# Altium schematic sheet 02_POWER.SchDoc: =GlobalProjectName
size 594 x 420 mm; CheckedBy: A_D; Author: A_D; SheetNumber: 2; SheetTotal: 2; PageSetup: Record=PageOptions|CenterHorizontal=True|CenterVertical=True|PrintScale=0.70|XCorrection=1.00|YCorrection=1.00|PrintKind=2|BorderSize=5000000|LeftOffset=9000|BottomOffset=10100|Orientation=2|PaperLength=11176|PaperWidth=8636|Scale=100|PaperSource=259|PrintQuality=-3|MediaType=1|DitherType=10|PrintScaleMode=1|PaperKind=A3|PaperIndex=8
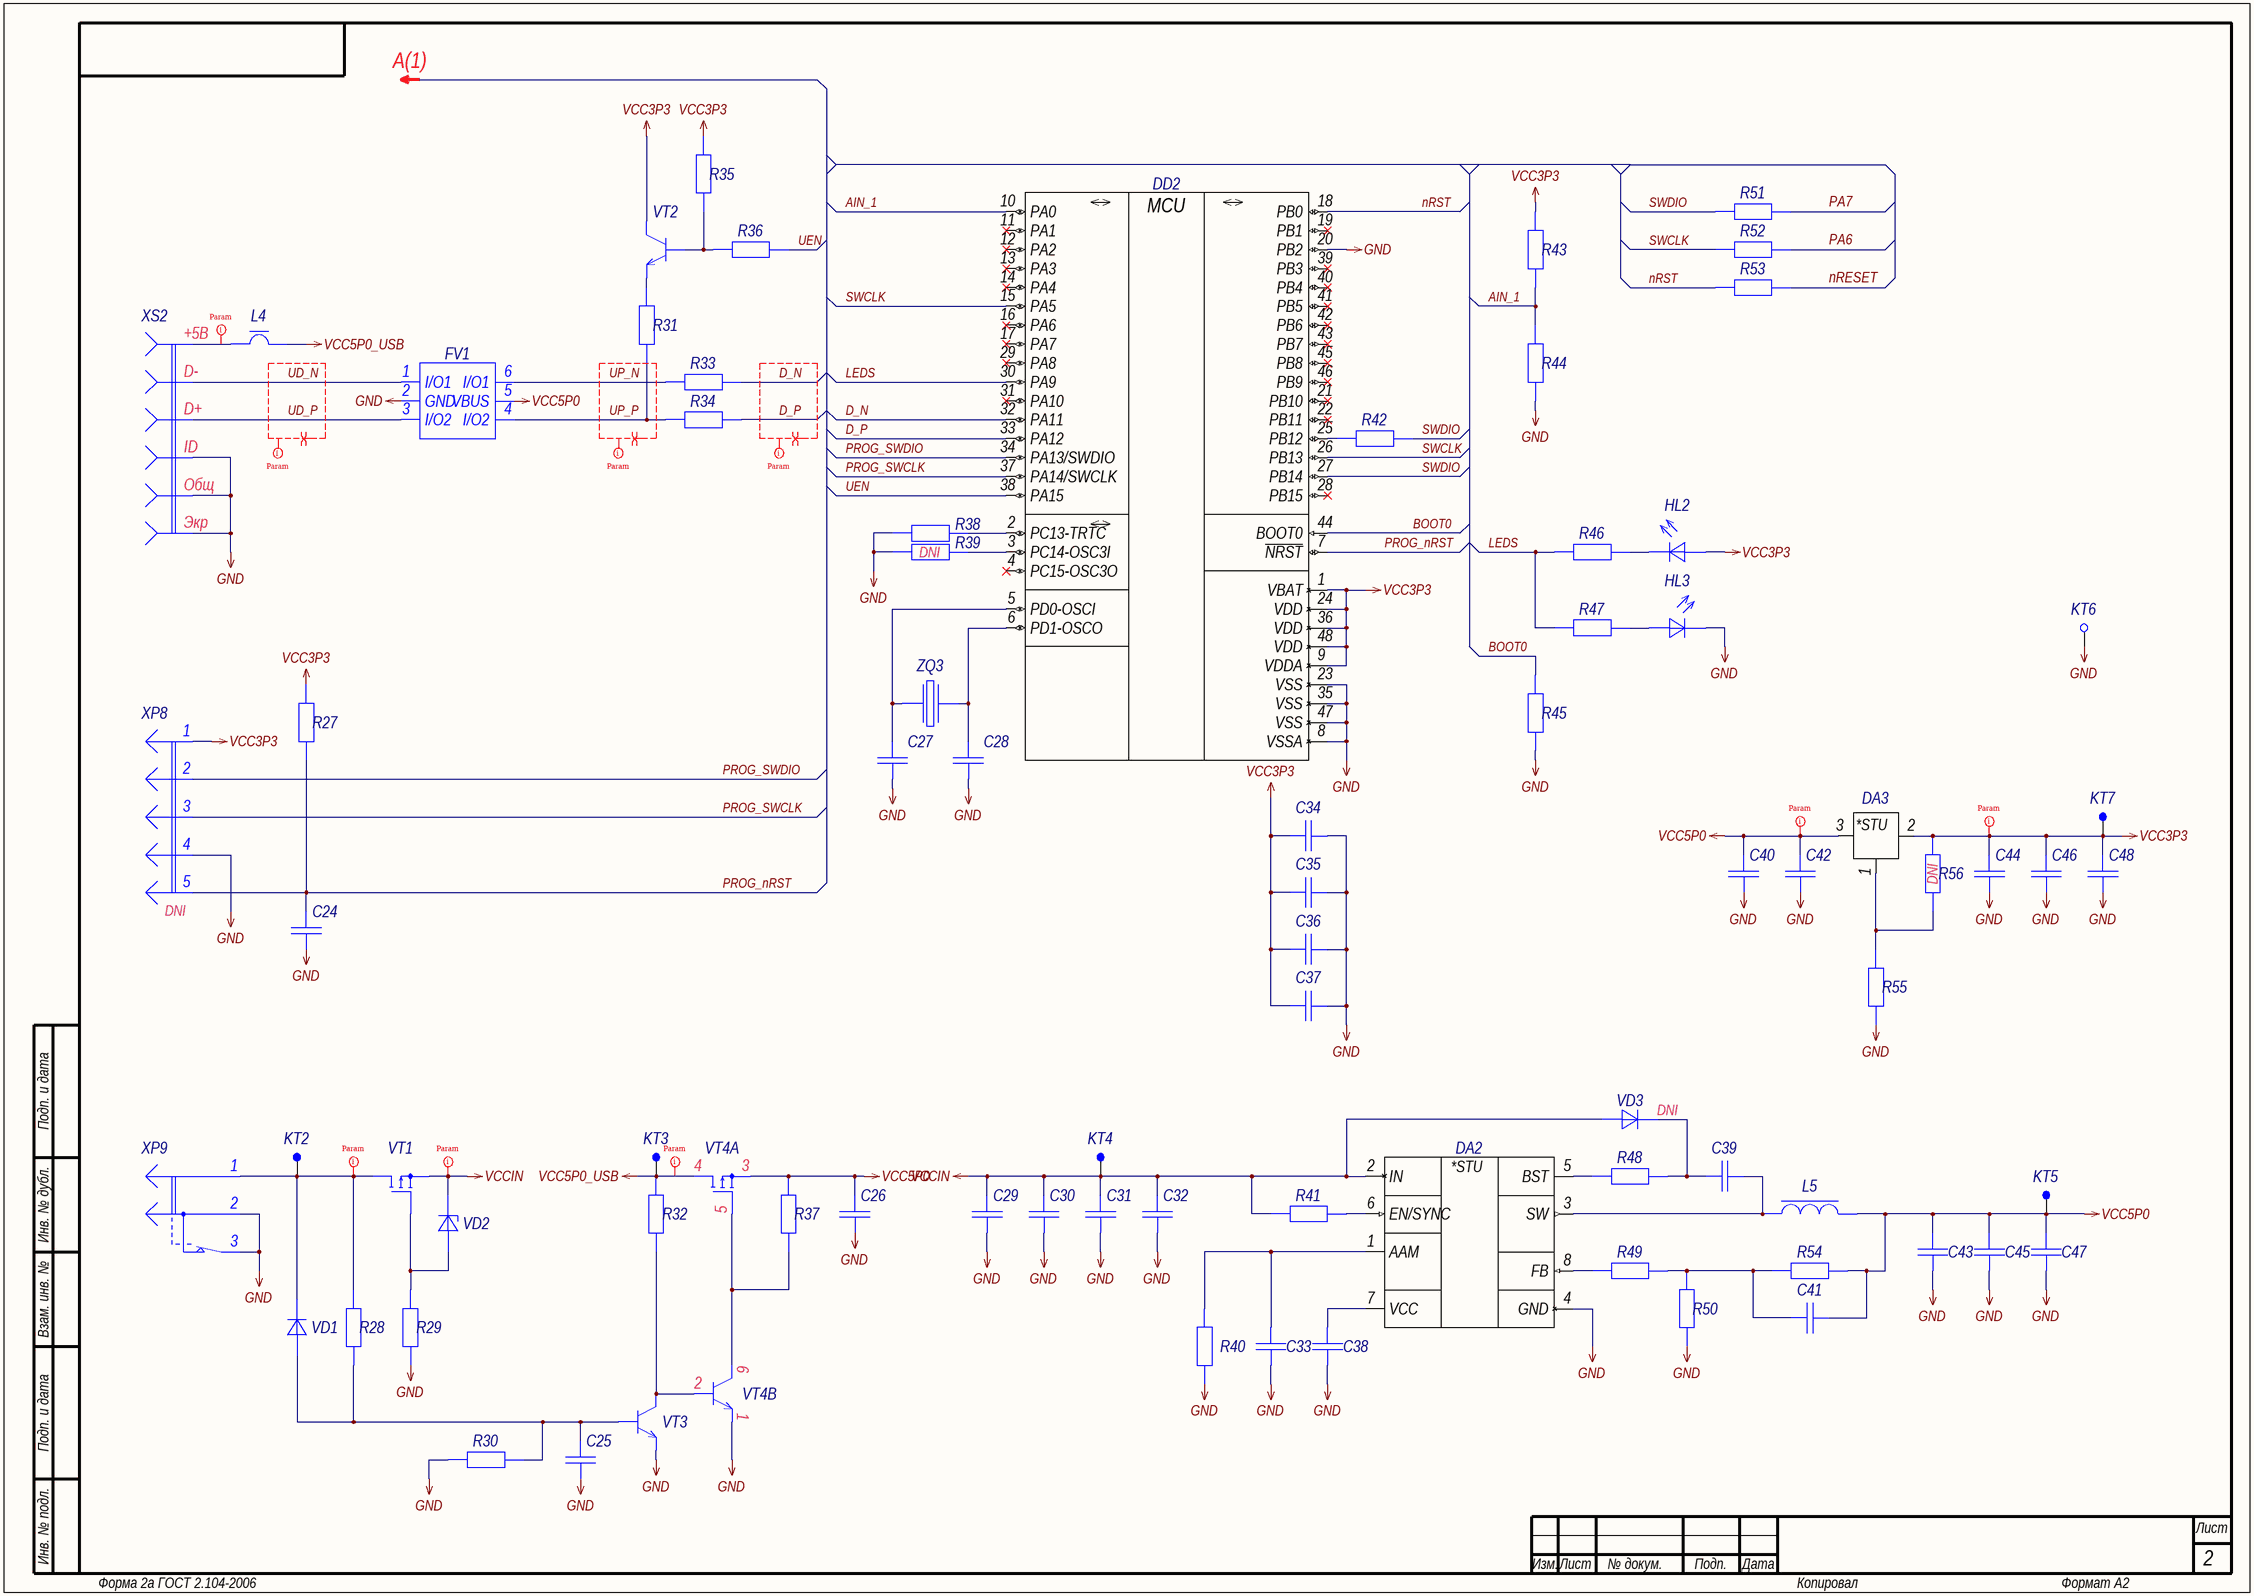
[diagram p0: 02_POWER.SchDoc]

## Parts
C24  Capacitor  [C0603_L]  (value not drawn)
C25  Capacitor  [C0603_L]  (value not drawn)
C26  Capacitor  [C0805_L]  (value not drawn)
C27  Capacitor  [C0603_L]  (value not drawn)
C28  Capacitor  [C0603_L]  (value not drawn)
C29  Capacitor  [C1206_L]  (value not drawn)
C30  Capacitor  [C1206_L]  (value not drawn)
C31  Capacitor  [C1206_L]  (value not drawn)
C32  Capacitor  [C0603_L]  (value not drawn)
C33  Capacitor  [C0603_L]  (value not drawn)
C34  Capacitor  [C0603_L]  (value not drawn)
C35  Capacitor  [C0603_L]  (value not drawn)
C36  Capacitor  [C0603_L]  (value not drawn)
C37  Capacitor  [C0603_L]  (value not drawn)
C38  Capacitor  [C0603_L]  (value not drawn)
C39  Capacitor  [C0603_L]  (value not drawn)
C40  Capacitor  [C0805_L]  (value not drawn)
C41  Capacitor  [C0603_L]  (value not drawn)
C42  Capacitor  [C0603_L]  (value not drawn)
C43  Capacitor  [C0805_L]  (value not drawn)
C44  Capacitor  [C0603_L]  (value not drawn)
C45  Capacitor  [C0805_L]  (value not drawn)
C46  Capacitor  [C0805_L]  (value not drawn)
C47  Capacitor  [C0805_L]  (value not drawn)
C48  Capacitor  [C0805_L]  (value not drawn)
DA2  MP2315GJ  [TSOT-23-8_065P290X160X100_N]  (value not drawn)
DA3  LM1117-Series  [SOT-223_230P650X350X180_N]  (value not drawn)
DD2  STM32F103Cxxx-Series  [LQFP-48_050P700X700X160_N]  (value not drawn)
FV1  USBLC6-2SC6  [SOT-23-6_095P290X160X145_N]  (value not drawn)
HL2  Text  [LD0603_L]  (value not drawn)
HL3  Text  [LD0603_L]  (value not drawn)
KT2  VCCIN  [TP-SMT-C-0.8mm]  (value not drawn)  (no BOM)
KT3  VBUS  [TP-SMT-C-0.8mm]  (value not drawn)  (no BOM)
KT4  VCCIN  [TP-SMT-C-0.8mm]  (value not drawn)  (no BOM)
KT5  +5V  [TP-SMT-C-0.8mm]  (value not drawn)  (no BOM)
KT6  ОБЩ  [5001]  (value not drawn)  (no BOM)
KT7  +3.3V  [TP-SMT-C-0.8mm]  (value not drawn)  (no BOM)
L4  FerriteBead  [L0603_L]  (value not drawn)
L5  Coil  [SRP5030T-Series]  (value not drawn)
R27  Resistor  [R0603_L]  (value not drawn)
R28  Resistor  [R0603_L]  (value not drawn)
R29  Resistor  [R0603_L]  (value not drawn)
R30  Resistor  [R0603_L]  (value not drawn)
R31  Resistor  [R0603_L]  (value not drawn)
R32  Resistor  [R0603_L]  (value not drawn)
R33  Resistor  [R0603_L]  (value not drawn)
R34  Resistor  [R0603_L]  (value not drawn)
R35  Resistor  [R0603_L]  (value not drawn)
R36  Resistor  [R0603_L]  (value not drawn)
R37  Resistor  [R0603_L]  (value not drawn)
R38  Resistor  [R0603_L]  (value not drawn)
R39  Resistor  [R0603_L]  (value not drawn)  (no BOM)
R40  Resistor  [R0603_L]  (value not drawn)
R41  Resistor  [R0603_L]  (value not drawn)
R42  Resistor  [R0603_L]  (value not drawn)
R43  Resistor  [R0603_L]  (value not drawn)
R44  Resistor  [R0603_L]  (value not drawn)
R45  Resistor  [R0603_L]  (value not drawn)
R46  Resistor  [R0603_L]  (value not drawn)
R47  Resistor  [R0603_L]  (value not drawn)
R48  Resistor  [R0603_L]  (value not drawn)
R49  Resistor  [R0603_L]  (value not drawn)
R50  Resistor  [R0603_L]  (value not drawn)
R51  Resistor  [R0603_L]  (value not drawn)
R52  Resistor  [R0603_L]  (value not drawn)
R53  Resistor  [R0603_L]  (value not drawn)
R54  Resistor  [R0603_L]  (value not drawn)
R55  Resistor  [R0603_L]  (value not drawn)
R56  Resistor  [R0603_L]  (value not drawn)  (no BOM)
VD1  Diode  [SOD-323]  (value not drawn)
VD2  Zener  [SOD-323]  (value not drawn)
VD3  Diode  [SOD-323]  (value not drawn)  (no BOM)
VT1  MOSFET-P  [SOT-23_190P290X160X145_N]  (value not drawn)
VT2  BJT-NPN  [SOT-23_190P290X160X145_N]  (value not drawn)
VT3  BJT-NPN  [SOT-23_190P290X160X145_N]  (value not drawn)
VT4  PMC85XP  [SOT-1118-2M_065P200X200X065_N]  (value not drawn)  (parts A,B of 2)
XP8  Prog  [PLS-5]  (value not drawn)  (no BOM)
XP9  DC  [DJK-02-Series]  (value not drawn)
XS2  J-Link  [1981568-1]  (value not drawn)
ZQ3  Crystal  [SMD 5x3.2mm]  (value not drawn)

## Nets
GND: C24.1 C25.1 C26.1 C27.1 C28.1 C29.1 C30.1 C31.1 C32.1 C33.1 C34.1 C35.1 C36.1 C37.1 C38.1 C40.1 C42.1 C43.1 C44.1 C45.1 C46.1 C47.1 C48.1 DA2.4(GND) DD2.8(VSSA) DD2.20(PB2) DD2.23(VSS) DD2.35(VSS) DD2.47(VSS) FV1.2(GND) HL3.2(К) KT6.1 R29.1 R30.2 R38.2 R39.2 R40.1 R44.1 R45.1 R50.1 R55.1 VT3.3(Э) VT4.1(Э) XP8.4 XP9.2 XP9.3 XS2.4 XS2.5 XS2.6
VCC3P3: C34.2 C35.2 C36.2 C37.2 C44.2 C46.2 C48.2 DA3.2(Out) DD2.1(VBAT) DD2.9(VDDA) DD2.24(VDD) DD2.36(VDD) DD2.48(VDD) HL2.1(А) KT7.1 R27.2 R35.2 R43.2 R56.2 VT2.2(К) XP8.1
VCC5P0: C26.2 C40.2 C41.2 C42.2 C43.2 C45.2 C47.2 DA3.3(In) FV1.5(VBUS) KT5.1 L5.2 R37.2 R54.2 VT4.3(S)
VCC5P0_USB: KT3.1 L4.2 R32.2 VT4.4(D)
VCCIN: C29.2 C30.2 C31.2 C32.2 DA2.2(IN) KT4.1 R41.1 VD2.2(К) VD3.1(А) VT1.3(S)
AIN_1: DD2.10(PA0) R43.1 R44.2
BOOT0: DD2.44(BOOT0) R45.2
D_N: DD2.32(PA11) R33.2
D_P: DD2.33(PA12) R34.2
LEDS: DD2.30(PA9) R46.1 R47.1
nRESET: R53.2
nRST: DD2.18(PB0) R53.1
PA6: R52.2
PA7: R51.2
PROG_nRST: C24.2 DD2.7(~{NRST}) R27.1 XP8.5
PROG_SWCLK: DD2.37(PA14/SWCLK) XP8.3
PROG_SWDIO: DD2.34(PA13/SWDIO) XP8.2
SWCLK: DD2.15(PA5) DD2.26(PB13) R52.1
SWDIO: DD2.27(PB14) R42.2 R51.1
UD_N: FV1.1(I/O1) XS2.2
UD_P: FV1.3(I/O2) XS2.3
UEN: DD2.38(PA15) R36.2
UP_N: FV1.6(I/O1) R33.1
UP_P: FV1.4(I/O2) R31.1 R34.1
NetC25_2: C25.2 R28.1 R30.1 VD1.1(А) VT3.1(Б)
NetC27_2: C27.2 DD2.5(PD0-OSCI) ZQ3.3
NetC28_2: C28.2 DD2.6(PD1-OSCO) ZQ3.1
NetC33_2: C33.2 DA2.1(AAM) R40.2
NetC38_2: C38.2 DA2.7(VCC)
NetC39_1: C39.1 R48.2 VD3.2(К)
NetC39_2: C39.2 DA2.3(SW) L5.1
NetC41_1: C41.1 R49.2 R50.2 R54.1
NetDA2_5: DA2.5(BST) R48.1
NetDA2_6: DA2.6(EN/SYNC) R41.2
NetDA2_8: DA2.8(FB) R49.1
NetDA3_1: DA3.1(Adj/GND) R55.2 R56.1
NetDD2_2: DD2.2(PC13-TRTC) R38.1
NetDD2_3: DD2.3(PC14-OSC3I) R39.1
NetDD2_25: DD2.25(PB12) R42.1
NetHL2_2: HL2.2(К) R46.2
NetHL3_1: HL3.1(А) R47.2
NetKT2_1: KT2.1 R28.2 VD1.2(К) VT1.2(D) XP9.1
NetL4_1: L4.1 XS2.1
NetR29_2: R29.2 VD2.1(А) VT1.1(G)
NetR31_2: R31.2 VT2.3(Э)
NetR32_1: R32.1 VT3.2(К) VT4.2(Б)
NetR35_1: R35.1 R36.1 VT2.1(Б)
NetR37_1: R37.1 VT4.5(G) VT4.6(К)

Not connected (* = marked no-connect by the designer): DD2 4(PC15-OSC3O)* 11(PA1)* 12(PA2)* 13(PA3)* 14(PA4)* 16(PA6)* 17(PA7)* 19(PB1)* 21(PB10)* 22(PB11)* 28(PB15)* 29(PA8)* 31(PA10)* 39(PB3)* 40(PB4)* 41(PB5)* 42(PB6)* 43(PB7)* 45(PB8)* 46(PB9)*

## Layout directives
differential pair: D_N, D_P, UD_N, UD_P, UP_N, UP_P
rule Matched Net Lengths [Tolerance = 1mm]: D_N, D_P, UD_N, UD_P, UP_N, UP_P
rule Polygon Connect Style [Style - Direct Connect]: NetKT2_1, NetL4_1, VCC3P3, VCC5P0, VCC5P0_USB, VCCIN

## Notes on the sheet
- А(1)
- (near R39) DNI
- (near R56) DNI
- (near XP8) DNI
- (near VD3) DNI
- Подп. и дата
- Инв. № дубл.
- Взам. инв. №
- Инв. № подл.
- Изм.
- Лист
- № докум.
- Подп.
- Дата
- Форма 2а ГОСТ 2.104-2006
- Копировал
- Формат А2
- (in symbol 1981568-1) +5В; D-; D+; ID; Общ; Экр
- (in symbol LM1117MPX-3.3) *STU
- (in symbol MP2315GJ-Z) *STU
- (in symbol STM32F103C8T6) MCU

## Library data of the parts
C24 C25 C32 C34-C39 C42 C44 = GRM188R72A104KA35D: Manufacturer: Murata; Type: Конденсатор; ID: 232; Value: 0.1uF; Voltage: 100V; Tolerance: ±10%; Dielectric Type: X7R; Application Category: 1; Working Temperature Min: -55°С; Working Temperature Max: +125°С; Published: 18.05.2010; Publisher: Andrew Danich; Part Number: GRM188R72A104KA35D; Footprint: 0603
  C32 C39: ClassName: PolyDirectConnect
C26 C40 C43 C45-C48 = GRM21BR60J226ME39L: Manufacturer: Murata; Type: Конденсатор; ID: 140; Value: 22uF; Voltage: 6.3V; Tolerance: ±20%; Dielectric Type: X5R; Application Category: 1; Working Temperature Min: -55°С; Working Temperature Max: +85°С; Published: 18.05.2010; Publisher: Andrew Danich; Part Number: GRM21BR60J226ME39L; Footprint: 0805; ClassName: PolyDirectConnect
C27 C28 = GCM1885C1H150JA16D: Manufacturer: Murata; Type: Конденсатор; ID: 214; Value: 15pF; Voltage: 50V; Tolerance: ±5%; Dielectric Type: NP0; Application Category: 1; Working Temperature Min: -55°С; Working Temperature Max: +125°С; Published: 18.05.2010; Publisher: Andrew Danich; Part Number: GCM1885C1H150JA16D; Footprint: 0603
C29-C31 = GRM31CR71A226KE15L: Manufacturer: Murata; Type: Конденсатор; ID: 238; Value: 22uF; Voltage: 10V; Tolerance: ±10%; Dielectric Type: X7R; Application Category: 1; Working Temperature Min: -55°С; Working Temperature Max: +125°С; Published: 18.05.2010; Publisher: Andrew Danich; Part Number: GRM31CR71A226KE15L; Footprint: 1206; ClassName: PolyDirectConnect
C33 = GRM1885C2A102JA01D: Manufacturer: Murata; Type: Конденсатор; ID: 135; Value: 1000pF; Voltage: 100V; Tolerance: ±5%; Dielectric Type: NP0; Application Category: 1; Working Temperature Min: -55°С; Working Temperature Max: +125°С; Published: 18.05.2010; Publisher: Andrew Danich; Part Number: GRM1885C2A102JA01D; Footprint: 0603
C41 = GRM1885C1H330JA01D: Manufacturer: Murata; Type: Конденсатор; ID: 123; Value: 33pF; Voltage: 50V; Tolerance: ±5%; Dielectric Type: NP0; Application Category: 1; Working Temperature Min: -55°С; Working Temperature Max: +125°С; Published: 18.05.2010; Publisher: Andrew Danich; Part Number: GRM1885C1H330JA01D; Footprint: 0603
DA2 = MP2315GJ-Z: Manufacturer: Monolithic Power Systems; ID: 38; Input Voltage: +4.5…24V; Output Current: 3A; Output Voltage: +0.8…22.8V; Shutdown Input: YES; Frequency: 500kHz; Application Category: 1; Working Temperature Min: -40°С; Working Temperature Max: +125°С; Functional Analog: MP2315GJ-P; Type: Микросхема; Published: 01.09.2018; Publisher: Andrew Danich; Part Number: MP2315GJ-Z; Value: MP2315GJ-Z; ClassName: PolyDirectConnect
DA3 = LM1117MPX-3.3: ID: 9; Input Voltage: +8.5…20V; Output Current: 800mA; Output Voltage: +3.3V; Application Category: 1; Published: 13.08.2015; Publisher: Andrew Danich; Type: Микросхема; Part Number: LM1117MPX-3.3; Value: LM1117MPX-3.3; ClassName: PolyDirectConnect
DD2 = STM32F103C8T6: Manufacturer: STMicroelectronics; ID: 20; Supply Operation: +2.0…3.6V; Flash: 64K; SRAM: 20K; Prog Interface: JTAG, SWD, UART; I/O Lines: 37; Operation Frequency: 72MHz; Application Category: 1; Working Temperature Min: -40°С; Working Temperature Max: +85°С; Published: 16.10.2015; Publisher: Andrew Danich; Type: Микросхема; Part Number: STM32F103C8T6; Value: STM32F103C8T6; EEPROM: -
FV1 = USBLC6-2SC6: Manufacturer: STMicroelectronics; ID: 11; Breakdown Voltage: 6V; Reverse Stand Off Voltage: 17V; Forward Voltage: 0.95V; Peak Forward Current: 5A; Junction Capacitance: 2.5pF; Directional: Bidirectional; Application Category: 1; Working Temperature Min: -40°С; Working Temperature Max: +125°С; Published: 21.02.2017; Publisher: Andrew Danich; Type: Супрессор; Part Number: USBLC6-2SC6; Value: USBLC6-2SC6; Functional Analog: -
HL2 = BL-LS0603GC: Type: Индикатор единичный; ID: 14; Forward Voltage: 2.3V; Forward Current: 30mA; Power Dissipation: 65mW; Color: Green; Leds: 1; Published: 03.12.2013; Publisher: Andrew Danich; Part Number: BL-LS0603GC; Value: BL-LS0603GC; Footprint: 0603; Application Category: 1
HL3 = BL-LS0603HC: Type: Индикатор единичный; ID: 13; Forward Voltage: 2.2V; Forward Current: 30mA; Power Dissipation: 65mW; Color: Red; Leds: 1; Published: 03.12.2013; Publisher: Andrew Danich; Part Number: BL-LS0603HC; Value: BL-LS0603HC; Footprint: 0603; Application Category: 1
KT2-KT5 KT7 = TestPoint-SMT: ID: 6; Application Type: On PCB Test Point; Application Category: 1; Published: 03.03.2015; Publisher: Andrew Danich; Part Number: TestPoint-SMT; Value: TestPoint-SMT; Manufacturer: -; Functional Analog: -
KT6 = 5001: Manufacturer: Keystone Electronics; ID: 2; Value: 5001; Limit Voltage: 100V; Rated Current: 0.5A; Application Type: Miniature THM Test Point; Application Category: 1; Published: 03.03.2015; Publisher: Andrew Danich; Part Number: 5001; Functional Analog: -
L4 = BLM18PG331SN1: Manufacturer: Murata; Type: Дроссель; ID: 1; Rated Current: 1.2A; Impedance at 100Mhz: 330ohm; Tolerance: ±25%; DC Resistance: 0.15ohm; Inductor Type: EMIFIL; Working Temperature Min: -55°С; Working Temperature Max: +125°С; Published: 14.11.2014; Publisher: Andrew Danich; Part Number: BLM18PG331SN1; Value: BLM18PG331SN1; Footprint: 0603; Application Category: 1
L5 = SRP5030T-4R7M: Manufacturer: Bourns; Type: Дроссель; ID: 78; Rated Current: 4.6A; Tolerance: ±20%; Inductance: 4.7uH; DC Resistance: 0.053ohm; Application Category: 1; Working Temperature Min: -40°С; Working Temperature Max: +125°С; Published: 20.05.2010; Publisher: Andrew Danich; Part Number: SRP5030T-4R7M; Value: SRP5030T-4R7M; Footprint: SRP5030T; ClassName: PolyDirectConnect
R27-R30 R32 R37-R39 R45 = RC0603JR-0710KL: Manufacturer: Yageo; ID: 12; Value: 10k; Limit Voltage: 50V; Tolerance: ±5%; Temperature Coefficient: 100ppm; Total Power Dissipation: 0.1W; Series Type: Thick-Film; Application Category: 1; Working Temperature Min: -55°С; Working Temperature Max: +155°С; Functional Analog: CR0603-JW-103E; Published: 24.03.2010; Publisher: Andrew Danich; Type: Резистор; Part Number: RC0603JR-0710KL; Footprint: 0603
R31 = RC0603JR-071K5L: Manufacturer: Yageo; ID: 8; Value: 1.5k; Limit Voltage: 50V; Tolerance: ±5%; Temperature Coefficient: 100ppm; Total Power Dissipation: 0.1W; Series Type: Thick-Film; Application Category: 1; Working Temperature Min: -55°С; Working Temperature Max: +155°С; Published: 24.03.2010; Publisher: Andrew Danich; Type: Резистор; Part Number: RC0603JR-071K5L; Footprint: 0603
R33 R34 R51-R53 = RC0603JR-0722RL: Manufacturer: Yageo; ID: 29; Value: 22; Limit Voltage: 50V; Tolerance: ±5%; Temperature Coefficient: 100ppm; Total Power Dissipation: 0.1W; Series Type: Thick-Film; Application Category: 1; Working Temperature Min: -55°С; Working Temperature Max: +155°С; Published: 24.03.2010; Publisher: Andrew Danich; Type: Резистор; Part Number: RC0603JR-0722RL; Footprint: 0603
R35 R43 R44 = RC0603JR-074K7L: Manufacturer: Yageo; ID: 56; Value: 4.7k; Limit Voltage: 50V; Tolerance: ±5%; Temperature Coefficient: 100ppm; Total Power Dissipation: 0.1W; Series Type: Thick-Film; Application Category: 1; Working Temperature Min: -55°С; Working Temperature Max: +155°С; Published: 24.03.2010; Publisher: Andrew Danich; Type: Резистор; Part Number: RC0603JR-074K7L; Footprint: 0603
R36 R42 = RC0603JR-07100R: Manufacturer: Yageo; ID: 10; Value: 100; Limit Voltage: 50V; Tolerance: ±5%; Temperature Coefficient: 100ppm; Total Power Dissipation: 0.1W; Series Type: Thick-Film; Application Category: 1; Working Temperature Min: -55°С; Working Temperature Max: +155°С; Functional Analog: CR0603-JW-101E; Published: 24.03.2010; Publisher: Andrew Danich; Type: Резистор; Part Number: RC0603JR-07100R; Footprint: 0603
R40 = RC0603FR-0763K4L: Manufacturer: Yageo; ID: 468; Value: 63.4k; Limit Voltage: 50V; Tolerance: ±1%; Temperature Coefficient: 100ppm; Total Power Dissipation: 0.1W; Series Type: Thick-Film; Application Category: 1; Working Temperature Min: -55°С; Working Temperature Max: +155°С; Published: 24.03.2010; Publisher: Andrew Danich; Type: Резистор; Part Number: RC0603FR-0763K4L; Footprint: 0603
R41 = RC0603JR-07100KL: Manufacturer: Yageo; ID: 11; Value: 100k; Limit Voltage: 50V; Tolerance: ±5%; Temperature Coefficient: 100ppm; Total Power Dissipation: 0.1W; Series Type: Thick-Film; Application Category: 1; Working Temperature Min: -55°С; Working Temperature Max: +155°С; Functional Analog: CR0603-JW-104E; Published: 24.03.2010; Publisher: Andrew Danich; Type: Резистор; Part Number: RC0603JR-07100KL; Footprint: 0603
R46 R47 = RC0603JR-07330RL: Manufacturer: Yageo; ID: 313; Value: 330; Limit Voltage: 50V; Tolerance: ±5%; Temperature Coefficient: 100ppm; Total Power Dissipation: 0.1W; Series Type: Thick-Film; Application Category: 1; Working Temperature Min: -55°С; Working Temperature Max: +155°С; Functional Analog: CR0603-JW-331E; Published: 24.03.2010; Publisher: Andrew Danich; Type: Резистор; Part Number: RC0603JR-07330RL; Footprint: 0603
R48 = RC0603JR-0720RL: Manufacturer: Yageo; ID: 469; Value: 20; Limit Voltage: 50V; Tolerance: ±5%; Temperature Coefficient: 100ppm; Total Power Dissipation: 0.1W; Series Type: Thick-Film; Application Category: 1; Working Temperature Min: -55°С; Working Temperature Max: +155°С; Published: 24.03.2010; Publisher: Andrew Danich; Type: Резистор; Part Number: RC0603JR-0720RL; Footprint: 0603
R49 = RC0603JR-0733KL: Manufacturer: Yageo; ID: 47; Value: 33k; Limit Voltage: 50V; Tolerance: ±5%; Temperature Coefficient: 100ppm; Total Power Dissipation: 0.1W; Series Type: Thick-Film; Application Category: 1; Working Temperature Min: -55°С; Working Temperature Max: +155°С; Published: 24.03.2010; Publisher: Andrew Danich; Type: Резистор; Part Number: RC0603JR-0733KL; Footprint: 0603
R50 = RC0603JR-076K8L: Manufacturer: Yageo; ID: 71; Value: 6.8k; Limit Voltage: 50V; Tolerance: ±5%; Temperature Coefficient: 100ppm; Total Power Dissipation: 0.1W; Series Type: Thick-Film; Application Category: 1; Working Temperature Min: -55°С; Working Temperature Max: +155°С; Published: 24.03.2010; Publisher: Andrew Danich; Type: Резистор; Part Number: RC0603JR-076K8L; Footprint: 0603
R54 = RC0603JR-0736KL: Manufacturer: Yageo; ID: 49; Value: 36k; Limit Voltage: 50V; Tolerance: ±5%; Temperature Coefficient: 100ppm; Total Power Dissipation: 0.1W; Series Type: Thick-Film; Application Category: 1; Working Temperature Min: -55°С; Working Temperature Max: +155°С; Published: 24.03.2010; Publisher: Andrew Danich; Type: Резистор; Part Number: RC0603JR-0736KL; Footprint: 0603
R55 R56 = RC0603JR-070R: Manufacturer: Yageo; ID: 5; Value: 0; Limit Voltage: 50V; Tolerance: ±5%; Temperature Coefficient: 100ppm; Total Power Dissipation: 0.1W; Series Type: Thick-Film; Application Category: 1; Working Temperature Min: -55°С; Working Temperature Max: +155°С; Functional Analog: RC0603FR-070RL, CR0603-J/-000E; Published: 24.03.2010; Publisher: Andrew Danich; Type: Резистор; Part Number: RC0603JR-070R; Footprint: 0603
VD1 VD3 = 1N4148WS-7-F: Manufacturer: Diodes Incorporated; Type: Диод; ID: 13; Reverse Voltage: 100V; Reverse Current: 1uA; Forward Voltage: 1V; Forward Current: 150mA; Total Power Dissipation: 200mW; Capacitance: 2pF; Recovery Time: 4nS; Application Category: 1; Working Temperature Min: -55°С; Working Temperature Max: +150°С; Published: 18.05.2010; Publisher: Andrew Danich; Part Number: 1N4148WS-7-F; Value: 1N4148WS-7-F; Functional Analog: 1N4148WS
VD2 = BZX384-C12: Manufacturer: NXP; Type: Стабилитрон; ID: 20; Working Voltage: 12V; Reverse Current: 0.1uA; Forward Voltage: 0.9V; Forward Current: 250mA; Total Power Dissipation: 300mW; Capacitance: 85pF; Differential resistance: 150ohm; Application Category: 1; Working Temperature Min: -65°С; Working Temperature Max: +150°С; Published: 20.05.2013; Publisher: Andrew Danich; Part Number: BZX384-C12; Value: BZX384-C12
VT1 = IRLML9301TRPBF: Manufacturer: International Rectifier; Type: Транзистор; ID: 28; D-S Voltage: -30V; Drain Current: -3.6A; D-S On-Resistance: 0.103omh; Gate Capacitance: 388pF; Total Power Dissipation: 1.3W; Gate Threshold Voltage: -2.4V; Application Category: 1; Working Temperature Min: -55°С; Working Temperature Max: +150°С; Published: 10.02.2014; Publisher: Andrew Danich; Part Number: IRLML9301TRPBF; Value: IRLML9301TRPBF; ClassName: PolyDirectConnect
VT2 VT3 = BC847: Part Number: BC847; Type: Транзистор; ID: 1; Value: BC847; C-E Voltage: 45V; Collector Current: 100mA; C-E Saturation Voltage: 0.6V; DC Current Gain: 110…800; Total Power Dissipation: 250mW; Transition Frequency: 100MHz; Published: 07.05.2013; Publisher: Andrew Danich; Application Category: 1
VT4 = PMC85XP: Manufacturer: NXP Semiconductors; Type: Сборка транзисторная; ID: 33; D-S Voltage: -30V; Drain Current: -3.4A; D-S On-Resistance: 110momh; Gate Capacitance: 680pF; Total Power Dissipation: 1.17W; Gate Threshold Voltage: -1.2V; Application Category: 1; Working Temperature Min: -55°С; Working Temperature Max: +150°С; Published: 13.03.2017; Publisher: Andrew Danich; Part Number: PMC85XP; Value: PMC85XP; Functional Analog: -; ClassName: PolyDirectConnect
XP8 = PLS-5: Value: PLS-5; ID: 4; Limit Voltage: 250V; Limit Current: 3A; Connector Type: Male; Resistance: 15momh; Surface Finish: Gold; Pitch: 2.54mm; Application Category: 1; Published: 07.03.2013; Publisher: Andrew Danich; Type: Вилка; Part Number: PLS-5; Pins: 5
XP9 = DJK-02A: Manufacturer: JIA YI; ID: 35; Limit Voltage: 250V; Limit Current: 2A; Connector Type: Male; Resistance: 20mohm; Surface Finish: Bronze; Application Category: 1; Functional Analog: K375A, WTJ-020-04PA; Value: DJK-02A; Published: 07.03.2013; Publisher: Andrew Danich; Type: Вилка; Part Number: DJK-02A; Pins: 3; ClassName: PolyDirectConnect
XS2 = 1981568-1: Manufacturer: TE Connectivity; ID: 30; Limit Voltage: 24V; Limit Current: 1A; Connector Type: Female; Interface: USB 2.0; Max Data Rate: 480 mbps; Application Category: 1; Published: 11.04.2016; Publisher: Andrew Danich; Type: Розетка; Part Number: 1981568-1; Value: 1981568-1; Pins: 9; Mount Type: Surface; ClassName: PolyDirectConnect
ZQ3 = KX-9A 8.0 MHz 30/50/100 16 pF: Manufacturer: Geyer; ID: 12; Output Frequency: 8MHz; Shunt Capacitance: 5pF; Load Capacitance: 16pF; Temperature Coefficient: ±50ppm; Application Category: 1; Working Temperature Min: -20°С; Working Temperature Max: +70°С; Published: 08.03.2013; Publisher: Andrew Danich; Type: Резонатор; Part Number: KX-9A 8.0 MHz 30/50/100 16 pF; Value: KX-9A 8.0 MHz 30/50/100 16 pF; Functional Analog: -